# EAGLE design starfruit (EAGLE 7.7.0)
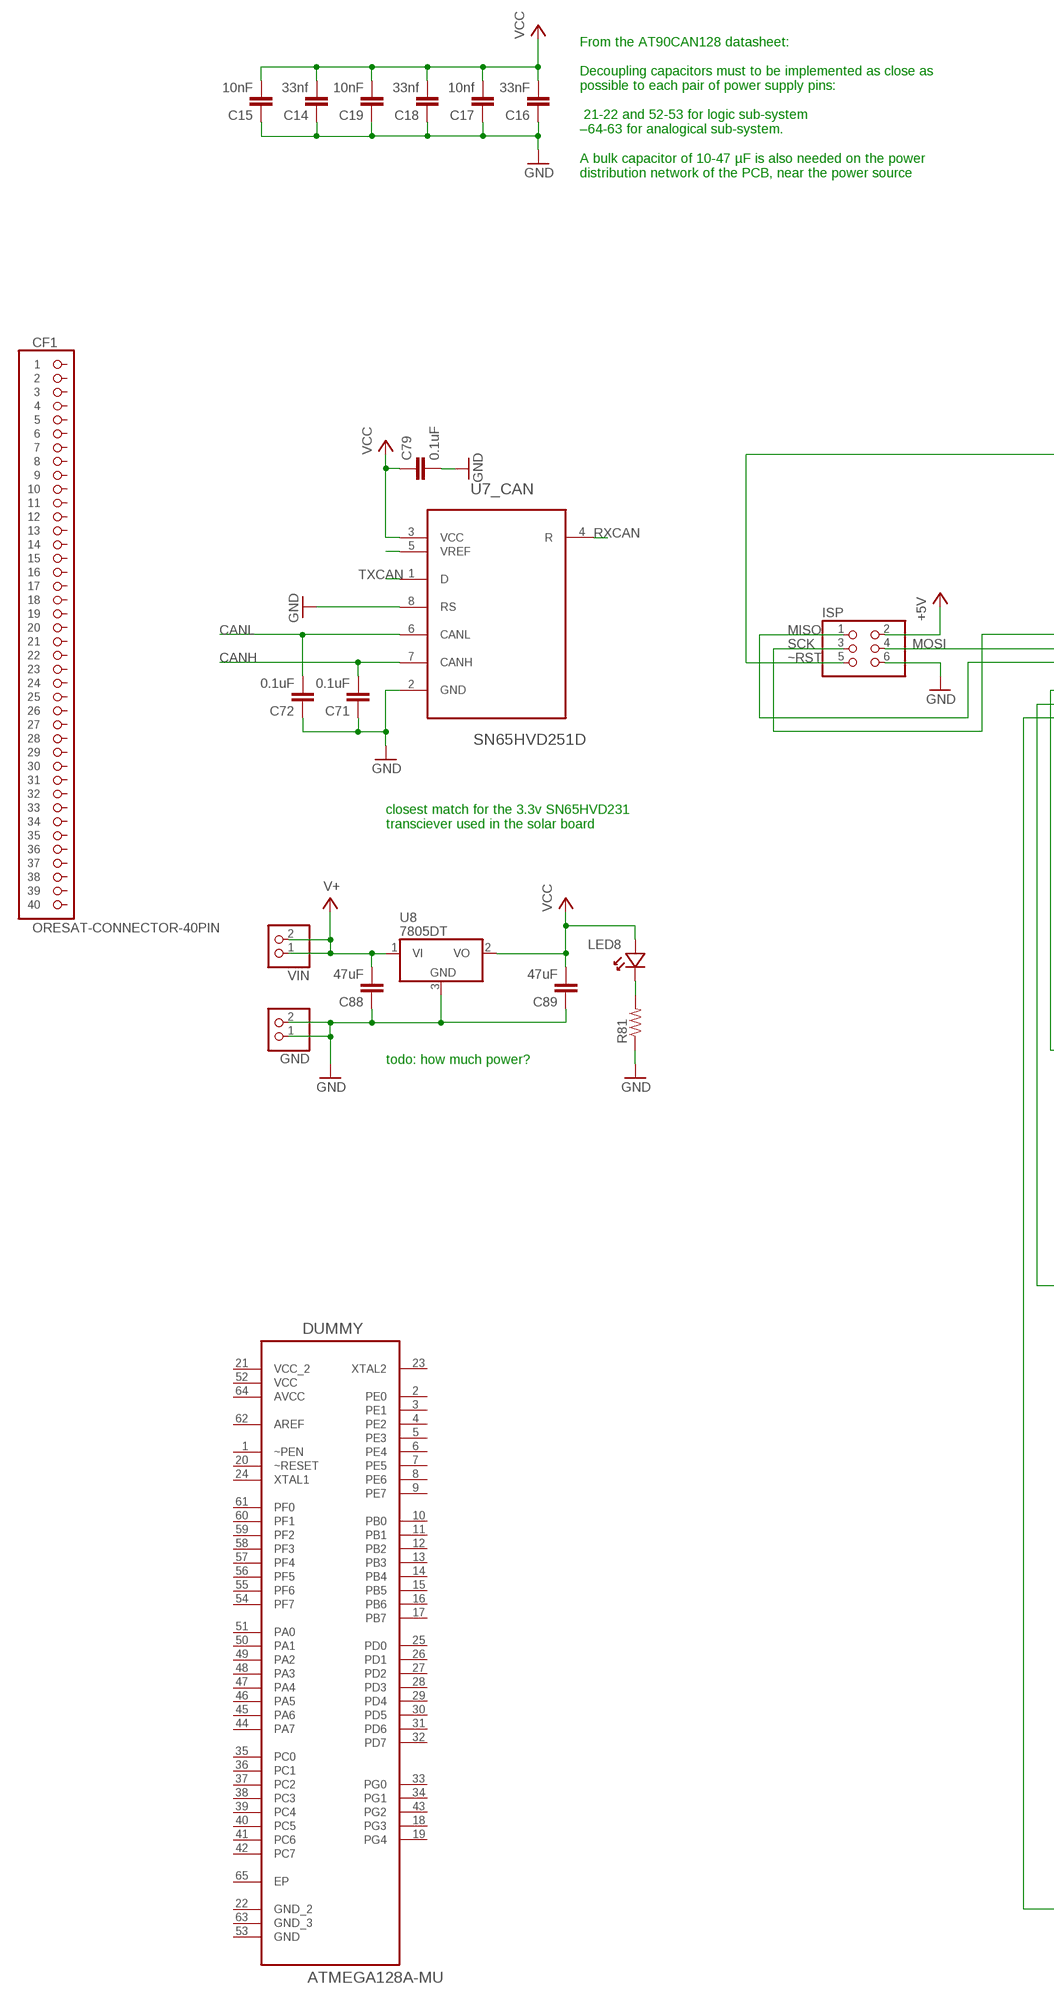
[diagram p0: schematic, sheet 1, part 1 of 2]
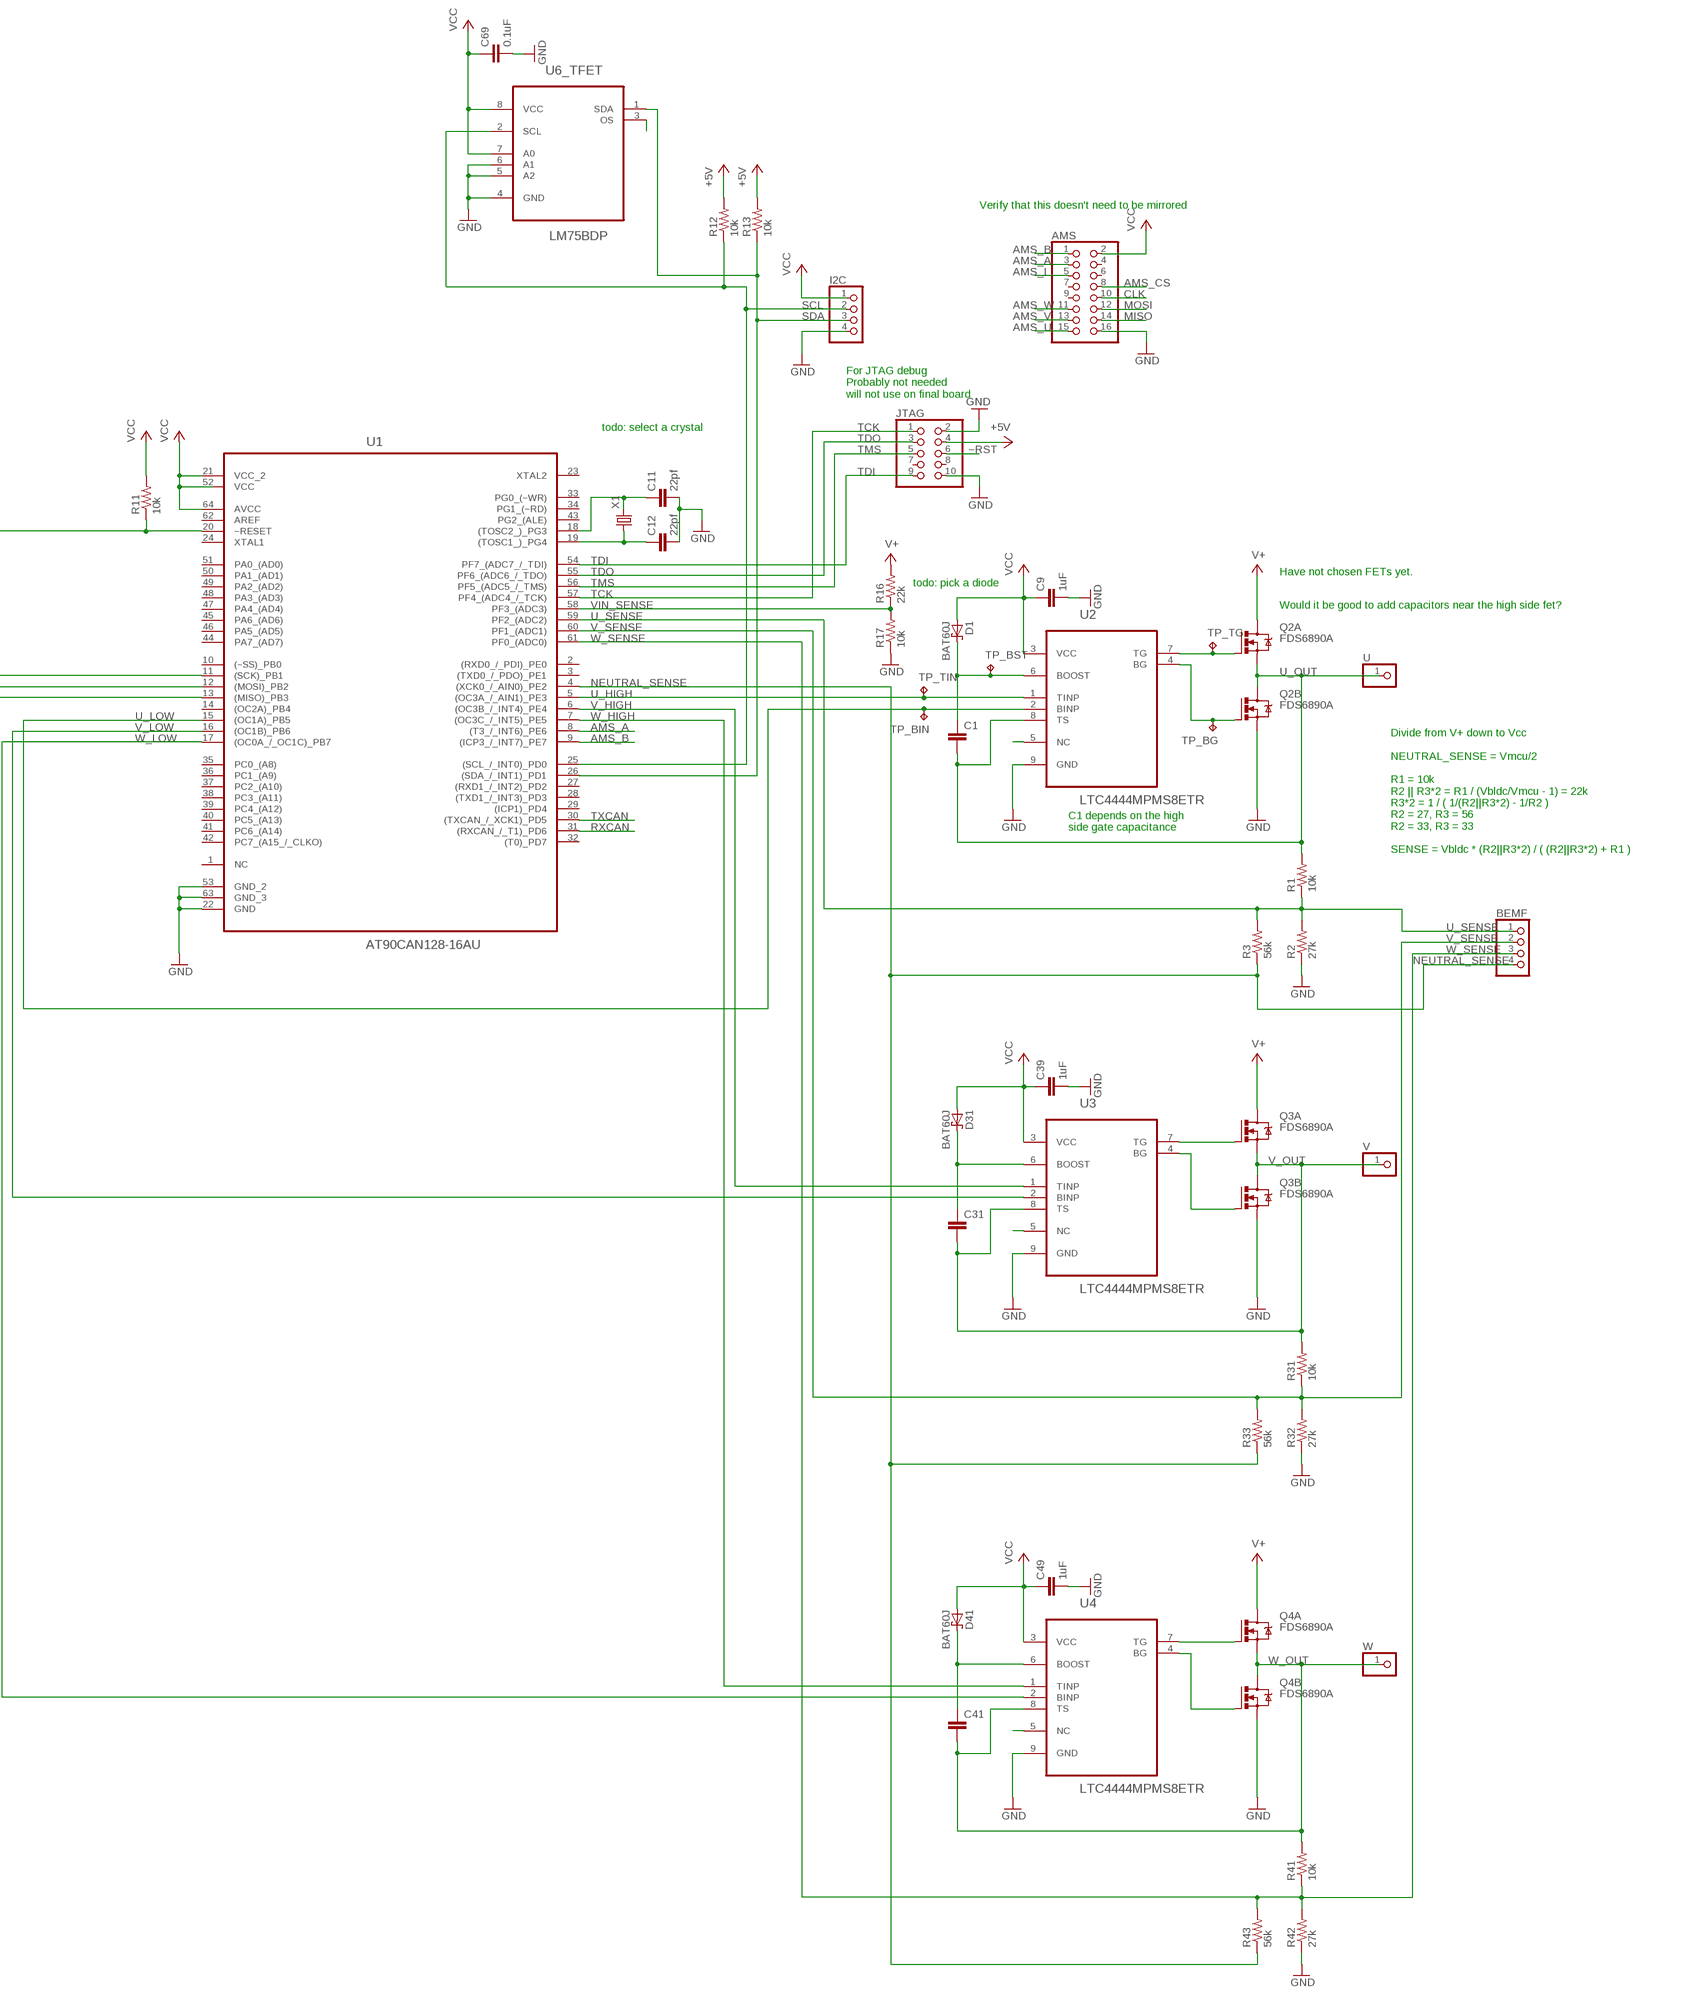
[diagram p1: schematic, sheet 1, part 2 of 2]

## Parts
AMS  PINHD-2X8  [2X08]
BEMF  PINHD-1X4  [1X04]
C1  C-EU0603-B-NOSILK  [.0603-B-NOSILK]
C9  1uF  C-EU0603-B-NOSILK  [.0603-B-NOSILK]
C11  22pf  C-EU0603-B-NOSILK  [.0603-B-NOSILK]
C12  22pf  C-EU0603-B-NOSILK  [.0603-B-NOSILK]
C14  33nf  C-EU0603-B-NOSILK  [.0603-B-NOSILK]
C15  10nF  C-EU0603-B-NOSILK  [.0603-B-NOSILK]
C16  33nF  C-EU0603-B-NOSILK  [.0603-B-NOSILK]
C17  10nf  C-EU0603-B-NOSILK  [.0603-B-NOSILK]
C18  33nf  C-EU0603-B-NOSILK  [.0603-B-NOSILK]
C19  10nF  C-EU0603-B-NOSILK  [.0603-B-NOSILK]
C31  C-EU0603-B-NOSILK  [.0603-B-NOSILK]
C39  1uF  C-EU0603-B-NOSILK  [.0603-B-NOSILK]
C41  C-EU0603-B-NOSILK  [.0603-B-NOSILK]
C49  1uF  C-EU0603-B-NOSILK  [.0603-B-NOSILK]
C69  0.1uF  C-EU0603-B-NOSILK  [.0603-B-NOSILK]
C71  0.1uF  C-EU0603-B-NOSILK  [.0603-B-NOSILK]
C72  0.1uF  C-EU0603-B-NOSILK  [.0603-B-NOSILK]
C79  0.1uF  C-EU0603-B-NOSILK  [.0603-B-NOSILK]
C88  47uF  C-EU0603-B-NOSILK  [.0603-B-NOSILK]
C89  47uF  C-EU0603-B-NOSILK  [.0603-B-NOSILK]
CF1  ORESAT-CONNECTOR-40PIN  [HARWIN-ARCHER-M50-3202045]
D1  BAT60J  [SOD323_ST]
D31  BAT60J  [SOD323_ST]
D41  BAT60J  [SOD323_ST]
DUMMY  ATMEGA128A-MU  [QFN50P900X900X100-65N]
GND  PINHD-1X2  [1X02]
I2C  PINHD-1X4  [1X04]
ISP  PINHD-2X3  [2X03]
JTAG  PINHD-2X5  [2X05]
LED8  LED-0603  [LED-0603]
Q2  FDS6890A  [M08A]
Q3  FDS6890A  [M08A]
Q4  FDS6890A  [M08A]
R1  10k  R-US_0603-B-NOSILK  [.0603-B-NOSILK]
R2  27k  R-US_0603-B-NOSILK  [.0603-B-NOSILK]
R3  56k  R-US_0603-B-NOSILK  [.0603-B-NOSILK]
R11  10k  R-US_0603-B-NOSILK  [.0603-B-NOSILK]
R12  10k  R-US_0603-B-NOSILK  [.0603-B-NOSILK]
R13  10k  R-US_0603-B-NOSILK  [.0603-B-NOSILK]
R16  22k  R-US_0603-B-NOSILK  [.0603-B-NOSILK]
R17  10k  R-US_0603-B-NOSILK  [.0603-B-NOSILK]
R31  10k  R-US_0603-B-NOSILK  [.0603-B-NOSILK]
R32  27k  R-US_0603-B-NOSILK  [.0603-B-NOSILK]
R33  56k  R-US_0603-B-NOSILK  [.0603-B-NOSILK]
R41  10k  R-US_0603-B-NOSILK  [.0603-B-NOSILK]
R42  27k  R-US_0603-B-NOSILK  [.0603-B-NOSILK]
R43  56k  R-US_0603-B-NOSILK  [.0603-B-NOSILK]
R81  R-US_0603-B-NOSILK  [.0603-B-NOSILK]
TP_BG  TPTP06R  [TP06R]
TP_BIN  TPTP06R  [TP06R]
TP_BST  TPTP06R  [TP06R]
TP_TG  TPTP06R  [TP06R]
TP_TIN  TPTP06R  [TP06R]
U  PINHD-1X1  [1X01]
U1  AT90CAN128-16AU  [QFP80P1600X1600X120-64N]
U2  LTC4444MPMS8ETR  [SOP65P490X110-9N]
U3  LTC4444MPMS8ETR  [SOP65P490X110-9N]
U4  LTC4444MPMS8ETR  [SOP65P490X110-9N]
U6_TFET  LM75BDP  [SOP65P490X110-8N]
U7_CAN  SN65HVD251D  [SOIC127P600X175-8N]
U8  7805DT  [TO252]
V  PINHD-1X1  [1X01]
VIN  PINHD-1X2  [1X02]
W  PINHD-1X1  [1X01]
X1  CRYSTALCTS406  [CTS406]

## Nets
AMS_A: AMS.3 U1.8((T3_/_INT6)_PE6)
AMS_B: AMS.1 U1.9((ICP3_/_INT7)_PE7)
AMS_CS: AMS.8
AMS_I: AMS.5
AMS_U: AMS.15
AMS_V: AMS.13
AMS_W: AMS.11
C79: C79.2 ; supply symbol labelled GND
CANH: C71.2 U7_CAN.7(CANH)
CANL: C72.2 U7_CAN.6(CANL)
CLK: AMS.10
GND: AMS.16 C9.2 C11.2 C12.2 C14.1 C15.1 C16.1 C17.1 C18.1 C19.1 C39.2 C49.2 C69.2 C71.1 C72.1 C88.1 C89.1 GND.1 GND.2 I2C.4 ISP.6 JTAG.2 JTAG.10 Q2.3(B:S) Q3.3(B:S) Q4.3(B:S) R2.1 R17.1 R32.1 R42.1 R81.1 U1.22(GND) U1.53(GND_2) U1.63(GND_3) U2.9(GND) U3.9(GND) U4.9(GND) U6_TFET.4(GND) U6_TFET.5(A2) U6_TFET.6(A1) U7_CAN.2(GND) U7_CAN.8(RS) U8.3(GND)
MISO: AMS.14 ISP.1 U1.13((MISO)_PB3)
MOSI: AMS.12 ISP.4 U1.12((MOSI)_PB2)
N$1: LED8.K R81.2
NEUTRAL_SENSE: BEMF.4 R3.1 R33.1 R43.1 U1.4((XCK0_/_AIN0)_PE2)
RXCAN: U1.31((RXCAN_/_T1)_PD6) U7_CAN.4(R)
SCK: ISP.3 U1.11((SCK)_PB1)
SCL: I2C.2 R12.1 U1.25((SCL_/_INT0)_PD0) U6_TFET.2(SCL)
SDA: I2C.3 R13.1 U1.26((SDA_/_INT1)_PD1) U6_TFET.1(SDA)
T_BG: Q3.4(B:G) U3.4(BG)
TCK: JTAG.1 U1.57(PF4_(ADC4_/_TCK))
TDI: JTAG.9 U1.54(PF7_(ADC7_/_TDI))
TDO: JTAG.3 U1.55(PF6_(ADC6_/_TDO))
TMS: JTAG.5 U1.56(PF5_(ADC5_/_TMS))
TOSC1: C12.1 U1.19((TOSC1_)_PG4) X1.1
TOSC2: C11.1 U1.18((TOSC2_)_PG3) X1.3
TXCAN: U1.30((TXCAN_/_XCK1)_PD5) U7_CAN.1(D)
U2_BOOST: C1.1 D1.C TP_BST.TP U2.6(BOOST)
U2_NC: U2.5(NC)
U3_BOOST: C31.1 D31.C U3.6(BOOST)
U3_NC: U3.5(NC)
U4_BOOST: C41.1 D41.C U4.6(BOOST)
U4_NC: U4.5(NC)
U6_NC: U6_TFET.3(OS)
U7_NC: U7_CAN.5(VREF)
U_BG: Q2.4(B:G) TP_BG.TP U2.4(BG)
U_HIGH: TP_TIN.TP U1.5((OC3A_/_AIN1)_PE3) U2.1(TINP)
U_LOW: TP_BIN.TP U1.15((OC1A)_PB5) U2.2(BINP)
U_OUT: C1.2 Q2.1(A:S) Q2.5(B:D) Q2.6(B:D) R1.2 U2.8(TS) U.1
U_SENSE: BEMF.1 R1.1 R2.2 R3.2 U1.59(PF2_(ADC2))
U_TG: Q2.2(A:G) TP_TG.TP U2.7(TG)
V+: C88.2 Q2.7(A:D) Q2.8(A:D) Q3.7(A:D) Q3.8(A:D) Q4.7(A:D) Q4.8(A:D) R16.2 U8.1(VI) VIN.1 VIN.2
V_HIGH: U1.6((OC3B_/_INT4)_PE4) U3.1(TINP)
V_LOW: U1.16((OC1B)_PB6) U3.2(BINP)
V_OUT: C31.2 Q3.1(A:S) Q3.5(B:D) Q3.6(B:D) R31.2 U3.8(TS) V.1
V_SENSE: BEMF.2 R31.1 R32.2 R33.2 U1.60(PF1_(ADC1))
V_TG: Q3.2(A:G) U3.7(TG)
VCC: AMS.2 C9.1 C14.2 C15.2 C16.2 C17.2 C18.2 C19.2 C39.1 C49.1 C69.1 C79.1 C89.2 D1.A D31.A D41.A I2C.1 ISP.2 JTAG.4 LED8.A R11.2 R12.2 R13.2 U1.21(VCC_2) U1.64(AVCC) U2.3(VCC) U3.3(VCC) U4.3(VCC) U6_TFET.7(A0) U6_TFET.8(VCC) U7_CAN.3(VCC) U8.2(VO) ; supply symbol labelled +5V
VIN_SENSE: R16.1 R17.2 U1.58(PF3_(ADC3))
W_BG: Q4.4(B:G) U4.4(BG)
W_HIGH: U1.7((OC3C_/_INT5)_PE5) U4.1(TINP)
W_LOW: U1.17((OC0A_/_OC1C)_PB7) U4.2(BINP)
W_OUT: C41.2 Q4.1(A:S) Q4.5(B:D) Q4.6(B:D) R41.2 U4.8(TS) W.1
W_SENSE: BEMF.3 R41.1 R42.2 R43.2 U1.61(PF0_(ADC0))
W_TG: Q4.2(A:G) U4.7(TG)
~RST: ISP.5 JTAG.6 R11.1 U1.20(~RESET)
Unconnected: AMS.4 AMS.6 AMS.7 AMS.9 CF1.P$1 CF1.P$2 CF1.P$3 CF1.P$4 CF1.P$5 CF1.P$6 CF1.P$7 CF1.P$8 CF1.P$9 CF1.P$10 CF1.P$11 CF1.P$12 CF1.P$13 CF1.P$14 CF1.P$15 CF1.P$16 CF1.P$17 CF1.P$18 CF1.P$19 CF1.P$20 CF1.P$21 CF1.P$22 CF1.P$23 CF1.P$24 CF1.P$25 CF1.P$26 CF1.P$27 CF1.P$28 CF1.P$29 CF1.P$30 CF1.P$31 CF1.P$32 CF1.P$33 CF1.P$34 CF1.P$35 CF1.P$36 CF1.P$37 CF1.P$38 CF1.P$39 CF1.P$40 DUMMY.1(~PEN) DUMMY.2(PE0) DUMMY.3(PE1) DUMMY.4(PE2) DUMMY.5(PE3) DUMMY.6(PE4) DUMMY.7(PE5) DUMMY.8(PE6) DUMMY.9(PE7) DUMMY.10(PB0) DUMMY.11(PB1) DUMMY.12(PB2) DUMMY.13(PB3) DUMMY.14(PB4) DUMMY.15(PB5) DUMMY.16(PB6) DUMMY.17(PB7) DUMMY.18(PG3) DUMMY.19(PG4) DUMMY.20(~RESET) DUMMY.22(GND_2) DUMMY.23(XTAL2) DUMMY.24(XTAL1) DUMMY.25(PD0) DUMMY.26(PD1) DUMMY.27(PD2) DUMMY.28(PD3) DUMMY.29(PD4) DUMMY.30(PD5) DUMMY.31(PD6) DUMMY.32(PD7) DUMMY.33(PG0) DUMMY.34(PG1) DUMMY.35(PC0) DUMMY.36(PC1) DUMMY.37(PC2) DUMMY.38(PC3) DUMMY.39(PC4) DUMMY.40(PC5) DUMMY.41(PC6) DUMMY.42(PC7) DUMMY.43(PG2) DUMMY.44(PA7) DUMMY.45(PA6) DUMMY.46(PA5) DUMMY.47(PA4) DUMMY.48(PA3) DUMMY.49(PA2) DUMMY.50(PA1) DUMMY.51(PA0) DUMMY.53(GND) DUMMY.54(PF7) DUMMY.55(PF6) DUMMY.56(PF5) DUMMY.57(PF4) DUMMY.58(PF3) DUMMY.59(PF2) DUMMY.60(PF1) DUMMY.61(PF0) DUMMY.62(AREF) DUMMY.63(GND_3) DUMMY.65(EP) JTAG.7 JTAG.8 U1.1(NC) U1.2((RXD0_/_PDI)_PE0) U1.3((TXD0_/_PDO)_PE1) U1.10((~SS)_PB0) U1.14((OC2A)_PB4) U1.23(XTAL2) U1.24(XTAL1) U1.27((RXD1_/_INT2)_PD2) U1.28((TXD1_/_INT3)_PD3) U1.29((ICP1)_PD4) U1.32((T0)_PD7) U1.33(PG0_(~WR)) U1.34(PG1_(~RD)) U1.35(PC0_(A8)) U1.36(PC1_(A9)) U1.37(PC2_(A10)) U1.38(PC3_(A11)) U1.39(PC4_(A12)) U1.40(PC5_(A13)) U1.41(PC6_(A14)) U1.42(PC7_(A15_/_CLKO)) U1.43(PG2_(ALE)) U1.44(PA7_(AD7)) U1.45(PA6_(AD6)) U1.46(PA5_(AD5)) U1.47(PA4_(AD4)) U1.48(PA3_(AD3)) U1.49(PA2_(AD2)) U1.50(PA1_(AD1)) U1.51(PA0_(AD0)) U1.62(AREF)

## Notes on the sheet
- Verify that this doesn't need to be mirrored
- From the AT90CAN128 datasheet:
  
  Decoupling capacitors must to be implemented as close as
  possible to each pair of power supply pins:
  
   21-22 and 52-53 for logic sub-system
  –64-63 for analogical sub-system.
  
  A bulk capacitor of 10-47 µF is also needed on the power
  distribution network of the PCB, near the power source
- For JTAG debug
  Probably not needed
  will not use on final board
- todo: select a crystal
- Have not chosen FETs yet.
- todo: pick a diode
- Would it be good to add capacitors near the high side fet?
- closest match for the 3.3v SN65HVD231
  transciever used in the solar board
- C1 depends on the high
  side gate capacitance
- Divide from V+ down to Vcc
  
  NEUTRAL_SENSE = Vmcu/2
  
  R1 = 10k
  R2 || R3*2 = R1 / (Vbldc/Vmcu - 1) = 22k
  R3*2 = 1 / ( 1/(R2||R3*2) - 1/R2 )
  R2 = 27, R3 = 56
  R2 = 33, R3 = 33
  
  SENSE = Vbldc * (R2||R3*2) / ( (R2||R3*2) + R1 )
- todo: how much power?

## Power pins joined to a net without a drawn wire
AVCC: DUMMY.64(AVCC)
VCC: DUMMY.52(VCC) U1.52(VCC)
VCC_2: DUMMY.21(VCC_2)

## Library data of the parts
AMS = pinhead:PINHD-2X8: PIN HEADER
BEMF I2C = pinhead:PINHD-1X4: PIN HEADER
C1 C9 C11 C12 C14-C19 C31 C39 C41 C49 C69 C71 C72 C79 C88 C89 = psas_c3_team05:C-EU: CAPACITOR, European symbol
CF1 = oresat-eagle:ORESAT-CONNECTOR-40PIN: OreSat 40pin card connector. Uses the Harwin Archer M50-3202045.
D1 D31 D41 = diode:BAT60J: Schottky barrier diode Source: www.st.com, BAT60J.pdf
DUMMY = Atmel_By_element14_Batch_1-00:ATMEGA128A-MU: Programmable Flash; MPN: ATMEGA128A-MU; OC_FARNELL: 1773398; OC_NEWARK: 51R8676; PACKAGE: QFN-64; SUPPLIER: Atmel
GND VIN = pinhead:PINHD-1X2: PIN HEADER
ISP = psas_c3_team05:PINHD-2X3: PIN HEADER
JTAG = pinhead:PINHD-2X5: PIN HEADER
LED8 = psas_c3_team05:LED: Generic LED with Color designator as an attribute.
Q2-Q4 = transistor-power:FDS6890A: Dual N-Channel 2.5V Specified PowerTrenchTM MOSFET Source: FDS6890A.pdf
R1-R3 R11-R13 R16 R17 R31-R33 R41-R43 R81 = psas_c3_team05:R-US_: RESISTOR, American symbol
TP_BG TP_BIN TP_BST TP_TG TP_TIN = testpad:TP: Test pad
U V W = pinhead:PINHD-1X1: PIN HEADER
U1 = Atmel_By_element14_Batch_1-00:AT90CAN128-16AU: CAN Controller; MPN: AT90CAN128-16AU; OC_FARNELL: 1455065; OC_NEWARK: 58M3860; PACKAGE: TQFP-64; SUPPLIER: Atmel
U2-U4 = LTC_By_element14_Batch_1:LTC4444MPMS8ETR: High Voltage Synchronous N-Channel MOSFET Driver; MPN: LTC4444MPMS8E#TR; OC_FARNELL: -; OC_NEWARK: 78R8371; PACKAGE: MSOP-8; SUPPLIER: Linear Technology
U6_TFET = NXP_By_element14_Batch_1:LM75BDP: Digital temperature sensor and thermal watchdog; MPN: LM75BDP; OC_FARNELL: 1854079; OC_NEWARK: 30T2200; PACKAGE: TSSOP-8; SUPPLIER: NXP
U7_CAN = Texas Instruments_By_element14_Batch_1:SN65HVD251D: INDUSTRIAL CAN TRANSCEIVER; MPN: SN65HVD251D; OC_FARNELL: 1212364; OC_NEWARK: 16M2475; PACKAGE: SOIC-8; SUPPLIER: Texas Instruments
U8 = linear:78*: Positive VOLTAGE REGULATOR Source: http://cache.national.com/ds/LM/LM78L05.pdf http://www.fairchildsemi.com/ds/LM/LM7805.pdf
X1 = crystal:CRYSTAL: CRYSTAL; OC_FARNELL: unknown; OC_NEWARK: unknown

## Board
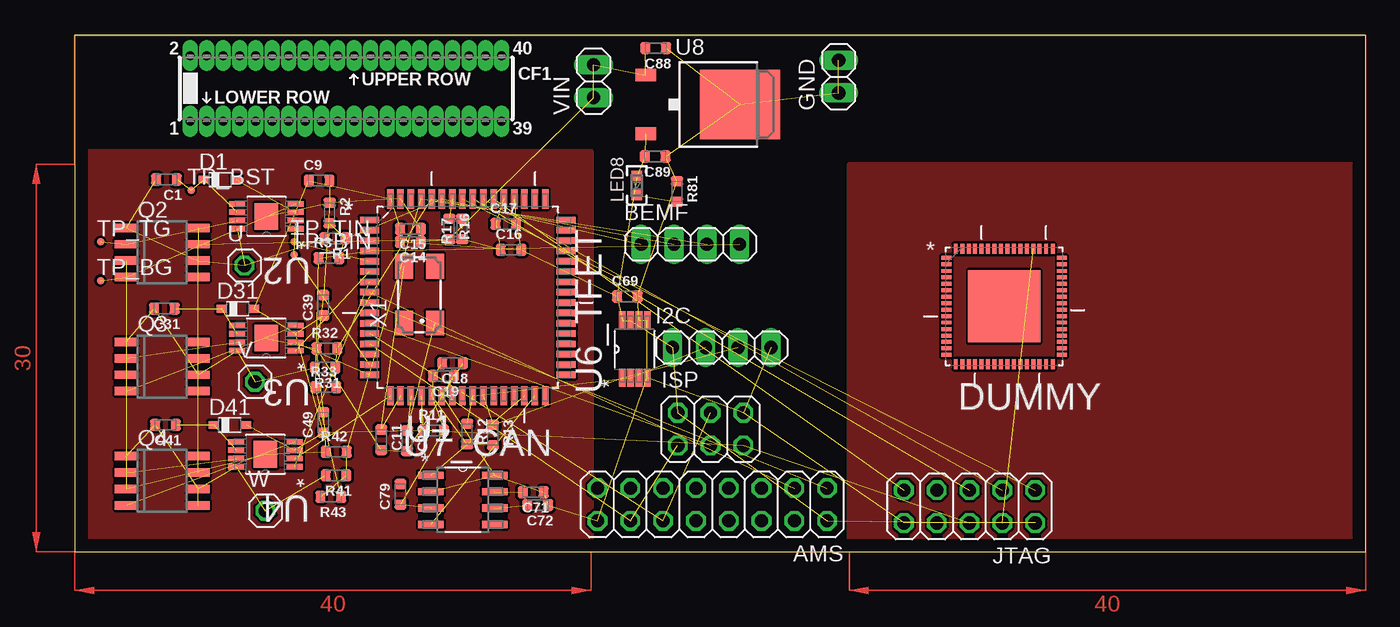
[diagram p2: board, top side]
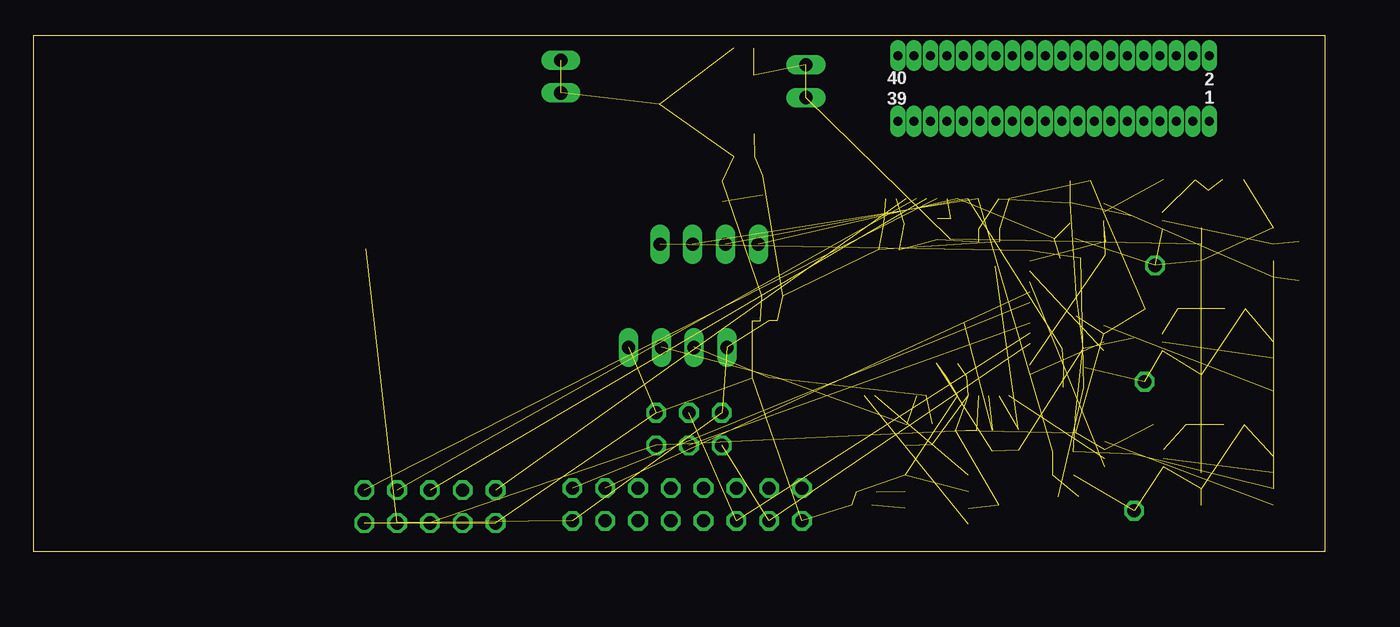
[diagram p3: board, bottom side, seen from below]

Size 100 x 40 mm. Coordinates in mm from the lower left corner, seen from the top.
Outline: 0,0 100,0 100,40 0,40 0,0
Copper layers (1*16): Top 0.035mm / dielectric 1.5mm / Bottom 0.035mm
Design rules "default": minimum track width 10mil, minimum drill 24mil, track to track 8mil, track to pad 8mil, pad to pad 8mil, via to via 8mil, smd to smd 8mil, copper to edge 40mil, drill to drill 8mil, minimum pad ring 10mil, minimum via ring 8mil, stop-mask expansion 4mil, vias tented up to drill 0mil, thermal gap 10mil

### Footprints (pad centres in the part's own frame; a part is rotated, then mirrored left to right if it is on the bottom)
2X08 = drill 1.016 octagon: 1 -8.89,-1.27; 2 -8.89,1.27; 3 -6.35,-1.27; 4 -6.35,1.27; 5 -3.81,-1.27; 6 -3.81,1.27; 7 -1.27,-1.27; 8 -1.27,1.27; 9 1.27,-1.27; 10 1.27,1.27; 11 3.81,-1.27; 12 3.81,1.27; 13 6.35,-1.27; 14 6.35,1.27; 15 8.89,-1.27; 16 8.89,1.27
1X04 = drill 1.016 long: 1 -3.81,0; 2 -1.27,0; 3 1.27,0; 4 3.81,0
.0603-B-NOSILK = smd 0.8 x 0.95: 1 -0.8,0; 2 0.8,0
HARWIN-ARCHER-M50-3202045 = drill 0.7 pad 1.07 long: P$1 -12.065,-2.54; P$2 -12.065,2.54; P$3 -10.795,-2.54; P$4 -10.795,2.54; P$5 -9.525,-2.54; P$6 -9.525,2.54; P$7 -8.255,-2.54; P$8 -8.255,2.54; P$9 -6.985,-2.54; P$10 -6.985,2.54; P$11 -5.715,-2.54; P$12 -5.715,2.54; P$13 -4.445,-2.54; P$14 -4.445,2.54; P$15 -3.175,-2.54; P$16 -3.175,2.54; P$17 -1.905,-2.54; P$18 -1.905,2.54; P$19 -0.635,-2.54; P$20 -0.635,2.54; P$21 0.635,-2.54; P$22 0.635,2.54; P$23 1.905,-2.54; P$24 1.905,2.54; P$25 3.175,-2.54; P$26 3.175,2.54; P$27 4.445,-2.54; P$28 4.445,2.54; P$29 5.715,-2.54; P$30 5.715,2.54; P$31 6.985,-2.54; P$32 6.985,2.54; P$33 8.255,-2.54; P$34 8.255,2.54; P$35 9.525,-2.54; P$36 9.525,2.54; P$37 10.795,-2.54; P$38 10.795,2.54; P$39 12.065,-2.54; P$40 12.065,2.54
SOD323_ST = smd 0.8 x 0.6: A 1.25,0; C -1.25,0
QFN50P900X900X100-65N = smd 0.762 x 0.305: 1 -4.47,3.759; 2 -4.47,3.251; 3 -4.47,2.743; 4 -4.47,2.261; 5 -4.47,1.753; 6 -4.47,1.245; 7 -4.47,0.762; 8 -4.47,0.254; 9 -4.47,-0.254; 10 -4.47,-0.762; 11 -4.47,-1.245; 12 -4.47,-1.753; 13 -4.47,-2.261; 14 -4.47,-2.743; 15 -4.47,-3.251; 16 -4.47,-3.759; 33 4.47,-3.759; 34 4.47,-3.251; 35 4.47,-2.743; 36 4.47,-2.261; 37 4.47,-1.753; 38 4.47,-1.245; 39 4.47,-0.762; 40 4.47,-0.254; 41 4.47,0.254; 42 4.47,0.762; 43 4.47,1.245; 44 4.47,1.753; 45 4.47,2.261; 46 4.47,2.743; 47 4.47,3.251; 48 4.47,3.759 | smd 0.305 x 0.762: 17 -3.759,-4.47; 18 -3.251,-4.47; 19 -2.743,-4.47; 20 -2.261,-4.47; 21 -1.753,-4.47; 22 -1.245,-4.47; 23 -0.762,-4.47; 24 -0.254,-4.47; 25 0.254,-4.47; 26 0.762,-4.47; 27 1.245,-4.47; 28 1.753,-4.47; 29 2.261,-4.47; 30 2.743,-4.47; 31 3.251,-4.47; 32 3.759,-4.47; 49 3.759,4.47; 50 3.251,4.47; 51 2.743,4.47; 52 2.261,4.47; 53 1.753,4.47; 54 1.245,4.47; 55 0.762,4.47; 56 0.254,4.47; 57 -0.254,4.47; 58 -0.762,4.47; 59 -1.245,4.47; 60 -1.753,4.47; 61 -2.261,4.47; 62 -2.743,4.47; 63 -3.251,4.47; 64 -3.759,4.47 | smd 5.588 x 5.588: 65 0,0
1X02 = drill 1.016 long: 1 -1.27,0; 2 1.27,0
2X03 = drill 1.016 octagon: 1 -2.54,-1.27; 2 -2.54,1.27; 3 0,-1.27; 4 0,1.27; 5 2.54,-1.27; 6 2.54,1.27
2X05 = drill 1.016 octagon: 1 -5.08,-1.27; 2 -5.08,1.27; 3 -2.54,-1.27; 4 -2.54,1.27; 5 0,-1.27; 6 0,1.27; 7 2.54,-1.27; 8 2.54,1.27; 9 5.08,-1.27; 10 5.08,1.27
LED-0603 = smd 0.8 x 0.8: A 0.75,0; K -0.75,0
M08A = smd 0.65 x 1.75: 1 -1.905,-2.8; 2 -0.635,-2.8; 3 0.635,-2.8; 4 1.905,-2.8; 5 1.905,2.8; 6 0.635,2.8; 7 -0.635,2.8; 8 -1.905,2.8
TP06R = smd 0.6 x 0.6: TP 0,0
1X01 = drill 1.016 octagon: 1 0,0
QFP80P1600X1600X120-64N = smd 1.473 x 0.508: 1 -7.62,5.994; 2 -7.62,5.207; 3 -7.62,4.394; 4 -7.62,3.607; 5 -7.62,2.794; 6 -7.62,2.007; 7 -7.62,1.194; 8 -7.62,0.406; 9 -7.62,-0.406; 10 -7.62,-1.194; 11 -7.62,-2.007; 12 -7.62,-2.794; 13 -7.62,-3.607; 14 -7.62,-4.394; 15 -7.62,-5.207; 16 -7.62,-5.994; 33 7.62,-5.994; 34 7.62,-5.207; 35 7.62,-4.394; 36 7.62,-3.607; 37 7.62,-2.794; 38 7.62,-2.007; 39 7.62,-1.194; 40 7.62,-0.406; 41 7.62,0.406; 42 7.62,1.194; 43 7.62,2.007; 44 7.62,2.794; 45 7.62,3.607; 46 7.62,4.394; 47 7.62,5.207; 48 7.62,5.994 | smd 0.508 x 1.473: 17 -5.994,-7.62; 18 -5.207,-7.62; 19 -4.394,-7.62; 20 -3.607,-7.62; 21 -2.794,-7.62; 22 -2.007,-7.62; 23 -1.194,-7.62; 24 -0.406,-7.62; 25 0.406,-7.62; 26 1.194,-7.62; 27 2.007,-7.62; 28 2.794,-7.62; 29 3.607,-7.62; 30 4.394,-7.62; 31 5.207,-7.62; 32 5.994,-7.62; 49 5.994,7.62; 50 5.207,7.62; 51 4.394,7.62; 52 3.607,7.62; 53 2.794,7.62; 54 2.007,7.62; 55 1.194,7.62; 56 0.406,7.62; 57 -0.406,7.62; 58 -1.194,7.62; 59 -2.007,7.62; 60 -2.794,7.62; 61 -3.607,7.62; 62 -4.394,7.62; 63 -5.207,7.62; 64 -5.994,7.62
SOP65P490X110-9N = smd 1.245 x 0.432: 1 -2.261,0.965; 2 -2.261,0.33; 3 -2.261,-0.33; 4 -2.261,-0.965; 5 2.261,-0.965; 6 2.261,-0.33; 7 2.261,0.33; 8 2.261,0.965 | smd 1.829 x 2.057: 9 0,0
SOP65P490X110-8N = smd 1.422 x 0.508: 1 -2.21,0.965; 2 -2.21,0.33; 3 -2.21,-0.33; 4 -2.21,-0.965; 5 2.21,-0.965; 6 2.21,-0.33; 7 2.21,0.33; 8 2.21,0.965
SOIC127P600X175-8N = smd 1.981 x 0.559: 1 -2.464,1.905; 2 -2.464,0.635; 3 -2.464,-0.635; 4 -2.464,-1.905; 5 2.464,-1.905; 6 2.464,-0.635; 7 2.464,0.635; 8 2.464,1.905
TO252 = smd 1 x 1.6: 1 -2.28,-4.8; 2 2.28,-4.8 | smd 5.4 x 6.2: 3 0,2.5
CTS406 = smd 1.9 x 1.4: 1 -2.2,-1.2; 2 2.2,-1.2; 3 2.2,1.2; 4 -2.2,1.2

### Placement (x,y rotation side)
AMS  49.39,3.66 180 top
BEMF  47.69,23.82 0 top
C1  7.1,28.83 180 top
C9  18.93,28.74 0 top
C11  23.74,8.67 270 top
C12  25.74,8.59 270 top
C14  26,24 180 top
C15  26,25 180 top
C16  33.79,23.39 0 top
C17  33.39,25.39 0 top
C18  29.26,14.61 180 top
C19  28.56,13.61 180 top
C31  6.94,18.83 180 top
C39  19.26,19.09 90 top
C41  7.02,9.83 180 top
C49  19.26,10.01 90 top
C69  42.8,19.77 0 top
C71  35.51,4.61 180 top
C72  35.86,3.61 180 top
C79  25.23,4.45 90 top
C88  45,39 180 top
C89  44.96,30.61 180 top
CF1  21.01,35.88 0 top
D1  11.25,28.82 0 top
D31  12.63,18.82 0 top
D41  12.01,9.82 0 top
DUMMY  72,19 0 top
GND  59.18,36.8 90 top
I2C  50.12,15.82 0 top
ISP  49.25,9.5 0 top
JTAG  69.32,3.5 180 top
LED8  43.54,28.37 90 top
Q2  6.77,23.18 270 top
Q3  6.77,14.34 270 top
Q4  6.77,5.5 270 top
R1  20.15,24.26 180 top
R2  19.74,26.23 270 top
R3  19.69,22.74 0 top
R11  27.8,9.39 0 top
R12  30.39,9.12 270 top
R13  32.39,9.04 270 top
R16  29,25 270 top
R17  30,25 90 top
R31  19.39,14.26 180 top
R32  19.53,15.74 0 top
R33  19.45,12.74 0 top
R41  20.24,5.91 180 top
R42  20.25,7.74 0 top
R43  19.83,4.26 180 top
R81  46.65,27.9 270 top
TP_BG  2,21 0 top
TP_BIN  17,23 0 top
TP_BST  9,28 0 top
TP_TG  2,24 0 top
TP_TIN  17,24 0 top
U  13.14,22.17 0 top
U1  30.44,19.7 0 top
U2  14.85,25.98 180 top
U3  14.83,16.55 180 top
U4  14.77,7.55 180 top
U6_TFET  43.38,15.69 90 top
U7_CAN  30.06,4.02 0 top
U8  49.02,34.64 270 top
V  13.95,13.17 0 top
VIN  40.18,36.45 90 top
W  14.76,3.17 0 top
X1  26.7,19.91 90 top

### Tracks (layer width: path | path; a pad name or v marks a point on that pad's centre or on a via)
AMS_A  (1 unrouted)
AMS_B  (1 unrouted)
CANH  (1 unrouted)
CANL  (1 unrouted)
GND  (42 unrouted)
MISO  (2 unrouted)
MOSI  (2 unrouted)
N$1  (1 unrouted)
N$5
  pour Top: 40,0 0,0 0,31 40,31
N$6
  pour Top: 60,0 60,30 100,30 100,0
NEUTRAL_SENSE  (4 unrouted)
RXCAN  (1 unrouted)
SCK  (1 unrouted)
SCL  (3 unrouted)
SDA  (3 unrouted)
T_BG  (1 unrouted)
TCK  (1 unrouted)
TDI  (1 unrouted)
TDO  (1 unrouted)
TMS  (1 unrouted)
TOSC1  (2 unrouted)
TOSC2  (2 unrouted)
TXCAN  (1 unrouted)
U2_BOOST  (3 unrouted)
U3_BOOST  (2 unrouted)
U4_BOOST  (2 unrouted)
U_BG  (2 unrouted)
U_HIGH  (2 unrouted)
U_LOW  (2 unrouted)
U_OUT  (6 unrouted)
U_SENSE  (4 unrouted)
U_TG  (2 unrouted)
V+  (10 unrouted)
V_HIGH  (1 unrouted)
V_LOW  (1 unrouted)
V_OUT  (6 unrouted)
V_SENSE  (4 unrouted)
V_TG  (1 unrouted)
VCC  (33 unrouted)
VIN_SENSE  (2 unrouted)
W_BG  (1 unrouted)
W_HIGH  (1 unrouted)
W_LOW  (1 unrouted)
W_OUT  (6 unrouted)
W_SENSE  (4 unrouted)
W_TG  (1 unrouted)
~RST  (3 unrouted)
(copper drawn outside any net)
  shapes: Top area x6

### Text on the board
_tNames: CF1 | U4 | LED1 | U3 | R4 | Q4 | U2 | VIN | GND | BEMF | U7 | I2C | R33 | R32 | U8 | R31 | R3 | R2 | R1 | U | V | W | C1 | C41 | C31 | R71 | R11 | R12 | R13 | C89 | D41 | D31 | D1 | R41 | C9 | C49 | C79 | C39 | C69 | R43 | R42 | C59 | Q3 | C11 | C12 | U6 | U5 | C17 | C18 | C19 | C16 | C72 | C71 | AMS | ISP | JTAG | Q2 | Q1 | U1
_tFinish: R4 | R33 | R32 | R31 | R3 | R2 | R1 | C1 | C41 | C31 | R71 | R11 | R12 | R13 | C89 | R41 | C9 | C49 | C79 | C39 | C69 | R43 | R42 | C59 | C11 | C12 | C17 | C18 | C19 | C16 | C72 | C71